# Altium schematic sheet IR_LED.SchDoc
size A4; SheetNumber: 3; SheetTotal: 7
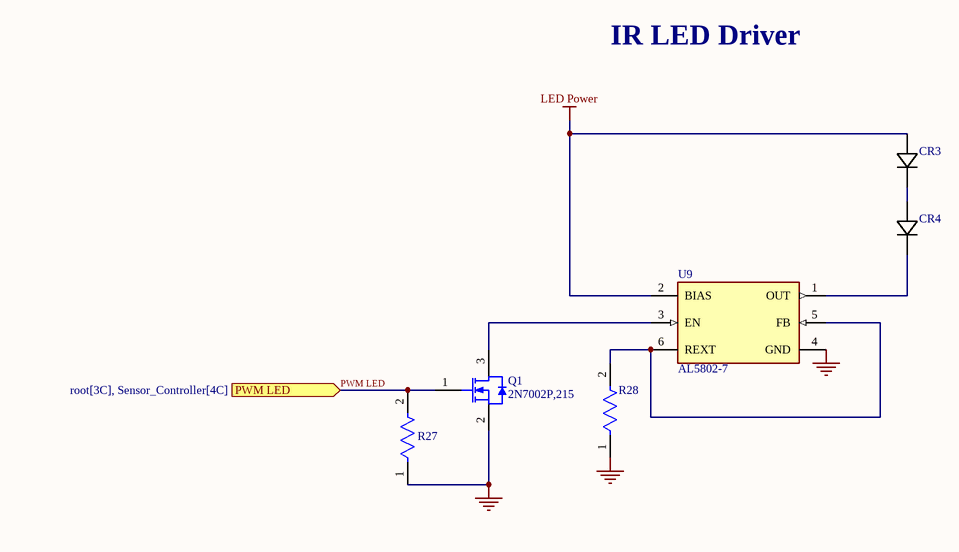
[diagram p0: IR_LED.SchDoc]

## Parts
CR3  VSMY2940GX01  [DIODE_VSMY2940GX01_VIS]  (value not drawn)
CR4  VSMY2940GX01  [DIODE_VSMY2940GX01_VIS]  (value not drawn)
Q1  2N7002P,215  [NXP-SOT23_L]
R27  RC0603FR-0710KL  [FP-RC0603-0_55-IPC_C]  (value not drawn)
R28  RT0402BRE0733RL  [FP-RT0402-MFG]  (value not drawn)
U9  AL5802-7  [Diodes_SOT26_SC74R_MFG]

## Ports
PWM LED (in, see root[3C], Sensor_Controller[4C])

## Nets
GND: Q1.2(S) R27.1 R28.1 U9.4(GND)
LED Power: CR3.2 U9.2(BIAS)
PWM LED: Q1.1(G) R27.2 ; port PWM LED
NetCR3_1: CR3.1 CR4.2
NetCR4_1: CR4.1 U9.1(OUT)
NetQ1_3: Q1.3(D) U9.3(EN)
NetR28_2: R28.2 U9.5(FB) U9.6(REXT)

## Notes on the sheet
- IR LED Driver

## Library data of the parts
CR3 CR4 = VSMY2940GX01: No Description Available; Mfr_Name: Vishay
Q1 = CMP-1259-00082-1: N-Channel Trench MOSFET, 60 V, 0.36 A, -55 to 150 degC, 3-Pin SOT23, Tape and Reel; Manufacturer: NXP Semiconductors; Channel Type: N; Automotive Qualified: Y; VDS [max] (V): 60; Packing: Tape & Reel; ID [max] (A): 0.36; VGSth [typ] (V): 1.75; IDM [max] (A): 1.2; ComponentLink2URL: http://www.nxp.com/documents/data_sheet/2N7002P.pdf; PackageReference: SOT23; PackageVersion: 06-03-16, 03/2006; ComponentLink1URL: http://www.nxp.com/; ComponentLink2Description: Datasheet; Mounting Technology: Surface Mount; PackageDescription: 3-Pin Small Outline Transistor Package, Body 2.9 x 1.3 mm, Pitch 0.95 mm; Code_JEDEC: TO-236AB; ComponentLink1Description: Manufacturer URL; PartNumber: 2N7002P,215; ComponentLink3Description: Package Specification; DatasheetVersion: Rev. 02; ComponentLink3URL: http://www.nxp.com/documents/outline_drawing/sot023_po.pdf
R27 = CMP-2100-03664-2: RES 10K OHM 1% 1/10W 0603; Voltage Rating: 75V; Voltage Rating (DC): 50V; Resistance: 10kR; Power Rating: 100mW; Temperature Coefficient: 100ppm/°C; Depth: 0.8mm; Termination: SMD/SMT; Resistor Type: Thick Film; Series: RC; Construction: Rectangular; Features: Moisture Resistant; Packaging: Tape and Reel; Min Operating Temperature: -55°C; Number of Terminations: 2; Lead Pitch: 0.3mm; RoHS Compliant: Yes; Case/Package: 0603; Resistance Tolerance: 1%; Military Standard: Not; Weight: 7.1E-05oz; Number of Pins: 2; Tolerance: 1%; Length: 1.6mm; Case Code (Imperial): 0603; Lead Free: Lead Free; Width: 0.8mm; Max Power Dissipation: 100mW; Height: 0.45mm; Max Operating Temperature: 155°C; Case Code (Metric): 1608; Size Code: 0603
R28 = CMP-2002-02979-2: RES SMD 33 OHM 0.1% 1/16W 0402; Manufacturer: Yageo; Power Rating: 0.063W; Temperature Coefficient: 50 ppm/°C; Tolerance: 0.001; Resistance: 33Ω; Value: 33Ω; Voltage Rating: 50V; Lead Free: Yes; Temperature Range Low: -55°C; ComponentLink2Description: Datasheet; Device Class L2: Resistors; Footprint Url: http://www.yageo.com/exep/pages/download/literatures/PYu-R_Mount_10.pdf; Temperature: -55°C to +155°C; Automotive: No; Manufacturer Part Number: RT0402BRE0733RL; Series: RT; Device Class L3: Chip SMD Resistors; Height: 0.35mm; Digikey Description: RES SMD 33 OHM 0.1% 1/16W 0402; Octopart: https://octopart.com/rt0402bre0733rl-yageo-1202878; Package: RT0402; ComponentLink2URL: http://www.yageo.com/documents/recent/PYu-RT_1-to-0.01_RoHS_L_9.pdf; Composition: Thin Film; Category: Res; Ipc Land Pattern Name: RESC10050X30; Device Class L1: Passive Components; RoHS: TRUE; Temperature Range High: +155°C
U9 = CMP-2000-05770-2: Manufacturer Package Identifier: SOT26 (SC74R); NexarPartId: 21363776; Output Voltage: 30V; Max Power Dissipation: 370mW; Output Current: 150mA; Nominal Supply Current: 120mA; Number of Channels: 2; Power Dissipation: 1W; Min Input Voltage (DC): 4.5V; Output Type: Adjustable; Number of Outputs: 1; Max Junction Temperature (Tj): 150°C; Dimming: PWM; Weight: 29.993795mg; Max Input Voltage (DC): 30V; RoHS: Compliant; Radiation Hardening: No; Max Operating Temperature: 125°C; Mount: Surface Mount; Height: 1.3mm; Lead Free: Lead Free; Case/Package: SOT-26; Width: 1.7mm; Ambient Temperature Range High: 125°C; Max Input Voltage: 30V; Number of Pins: 6; Max Supply Current: 120mA; REACH SVHC: No SVHC; Min Input Voltage: 4.5V; Schedule B: 8542390000, 8542390000; Max Supply Voltage: 30V; Min Supply Voltage: 4.5V; Contact Plating: Tin; Output Current per Channel: 120mA; Min Operating Temperature: -40°C; Length: 3.1mm